# EAGLE schematic fonte_simetrica (EAGLE 7.6.0)
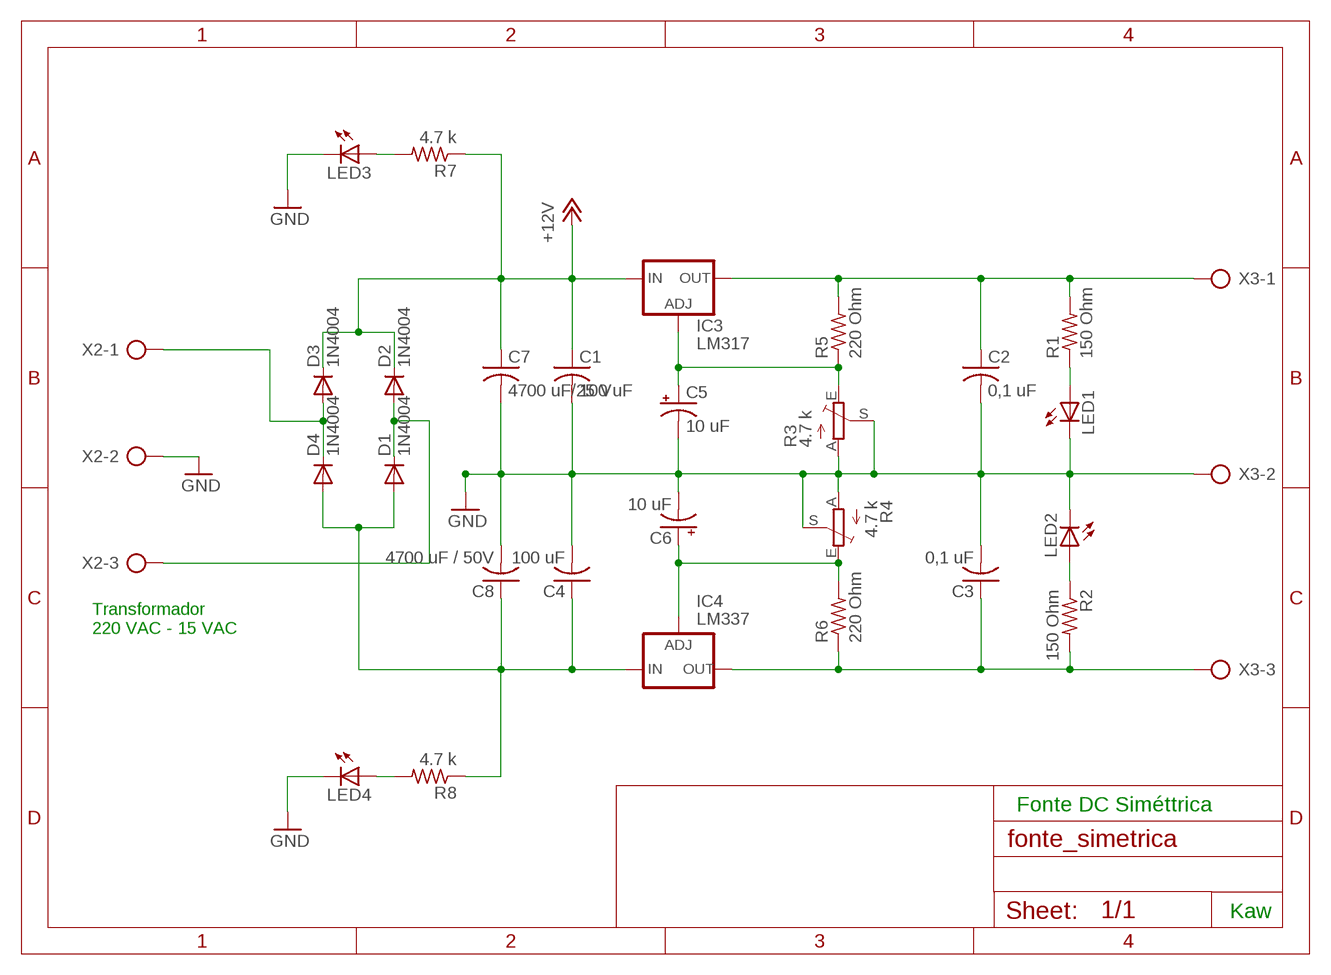
[diagram p0: schematic, sheet 1]

## Parts
C1  100 uF  C-US025-025X050  [C025-025X050]
C2  0,1 uF  C-US025-025X050  [C025-025X050]
C3  0,1 uF  C-US025-025X050  [C025-025X050]
C4  100 uF  C-US025-025X050  [C025-025X050]
C5  10 uF  CPOL-USE2.5-5V  [E2,5-4R]
C6  10 uF  CPOL-USE2.5-5V  [E2,5-4R]
C7  4700 uF/25 V  C-US025-025X050  [C025-025X050]
C8  4700 uF / 50V  C-US025-025X050  [C025-025X050]
D1  1N4004  [DO41-10]
D2  1N4004  [DO41-10]
D3  1N4004  [DO41-10]
D4  1N4004  [DO41-10]
IC3  LM317  LM317TS  [317TS]
IC4  LM337  LM337TS  [337TS]
LED1  LED5MM  [LED5MM]
LED2  LED5MM  [LED5MM]
LED3  LED5MM  [LED5MM]
LED4  LED5MM  [LED5MM]
R1  150 Ohm  R-US_0207/5V  [0207/5V]
R2  150 Ohm  R-US_0207/5V  [0207/5V]
R3  4.7 k  TRIM_EU-S64W  [S64W]
R4  4.7 k  TRIM_EU-S64W  [S64W]
R5  220 Ohm  R-US_0207/5V  [0207/5V]
R6  220 Ohm  R-US_0207/5V  [0207/5V]
R7  4.7 k  R-US_0207/5V  [0207/5V]
R8  4.7 k  R-US_0207/5V  [0207/5V]
X2  AK300/3  [AK300/3]
X3  AK300/3  [AK300/3]

## Nets
+12V: C1.1 C7.1 D2.C D3.C IC3.3(IN) R7.1
+12V1: C4.1 C8.1 D1.A D4.A IC4.2(IN) R8.1
GND: C1.2 C2.2 C3.2 C4.2 C5.- C6.- C7.2 C8.2 LED1.K(C) LED2.K(C) LED3.K(C) LED4.K(C) R3.A R3.S R4.A R4.S X2.2 X3.2
N$1: LED3.A R7.2
N$2: C3.1 IC4.3(OUT) R2.2 R6.1 X3.3
N$3: LED1.A R1.1
N$4: LED2.A R2.1
N$5: C2.1 IC3.2(OUT) R1.2 R5.2 X3.1
N$7: LED4.A R8.2
N$8: C5.+ IC3.1(ADJ) R3.E R5.1
N$9: D3.A D4.C X2.1
N$10: D1.C D2.A X2.3
N$12: C6.+ IC4.1(ADJ) R4.E R6.2

## Notes on the sheet
- Transformador
  220 VAC - 15 VAC
- Fonte DC Siméttrica
- Kaw

## Library data of the parts
C1-C4 C7 C8 = rcl:C-US: CAPACITOR, American symbol
C5 C6 = rcl:CPOL-US: POLARIZED CAPACITOR, American symbol
D1-D4 = diode:1N4004: DIODE general purpose rectifier, 1 A
IC3 = v-reg:LM317TS: VOLTAGE REGULATOR
IC4 = v-reg:LM337TS: VOLTAGE REGULATOR
LED1-LED4 = led:LED: LED OSRAM: - CHIPLED LG R971, LG N971, LY N971, LG Q971, LY Q971, LO R971, LY R971 LH N974, LH R974 LS Q976, LO Q976, LY Q976 LO Q996 - Hyper CHIPLED LW Q18S LB Q993, LB Q99A, LB R99A - SideLED LS A670, LO A670, LY A670, LG A670, LP A670 LB A673, LV A673, LT A673, LW A673 LH A674 LY A675 LS A676, LA A676, LO A676, LY A676, LW A676 LS A679, LY A679, LG A679 - Hyper Micro SIDELED® LS Y876, LA Y876, LO Y876, LY Y876 LT Y87S - SmartLED LW L88C, LW L88S LB L89C, LB L89S, LG L890 LS L89K, LO L89K, LY L89K LS L896, LA L896, LO L896, LY L896 - TOPLED LS T670, LO T670, LY T670, LG T670, LP T670 LSG T670, LSP T670, LSY T670, LOP T670, LYG T670 LG T671, LOG T671, LSG T671 LB T673, LV T673, LT T673, LW T673 LH T674 LS T676, LA T676, LO T676, LY T676, LB T676, LH T676, LSB T676, LW T676 LB T67C, LV T67C, LT T67C, LS T67K, LO T67K, LY T67K, LW E67C LS E67B, LA E67B, LO E67B, LY E67B, LB E67C, LV E67C, LT E67C LW T67C LS T679, LY T679, LG T679 LS T770, LO T770, LY T770, LG T770, LP T770 LB T773, LV T773, LT T773, LW T773 LH T774 LS E675, LA E675, LY E675, LS T675 LS T776, LA T776, LO T776, LY T776, LB T776 LHGB T686 LT T68C, LB T68C - Hyper Mini TOPLED® LB M676 - Mini TOPLED Santana® LG M470 LS M47K, LO M47K, LY M47K Source: http://www.osram.convergy.de LUXEON: - LUMILED® LXK2-PW12-R00, LXK2-PW12-S00, LXK2-PW14-U00, LXK2-PW14-V00 LXK2-PM12-R00, LXK2-PM12-S00, LXK2-PM14-U00 LXK2-PE12-Q00, LXK2-PE12-R00, LXK2-PE12-S00, LXK2-PE14-T00, LXK2-PE14-U00 LXK2-PB12-K00, LXK2-PB12-L00, LXK2-PB12-M00, LXK2-PB14-N00, LXK2-PB14-P00, LXK2-PB14-Q00 LXK2-PR12-L00, LXK2-PR12-M00, LXK2-PR14-Q00, LXK2-PR14-R00 LXK2-PD12-Q00, LXK2-PD12-R00, LXK2-PD12-S00 LXK2-PH12-R00, LXK2-PH12-S00 LXK2-PL12-P00, LXK2-PL12-Q00, LXK2-PL12-R00 Source: www.luxeon.com KINGBRIGHT: KA-3528ASYC Source: www.kingbright.com
R1 R2 R5-R8 = rcl:R-US_: RESISTOR, American symbol
R3 R4 = pot:TRIM_EU-: POTENTIOMETER
X2 X3 = con-ptr500:AK300/3: CONNECTOR; OC_FARNELL: unknown; OC_NEWARK: unknown